# EAGLE design voltage regulator (EAGLE 7.7.0)
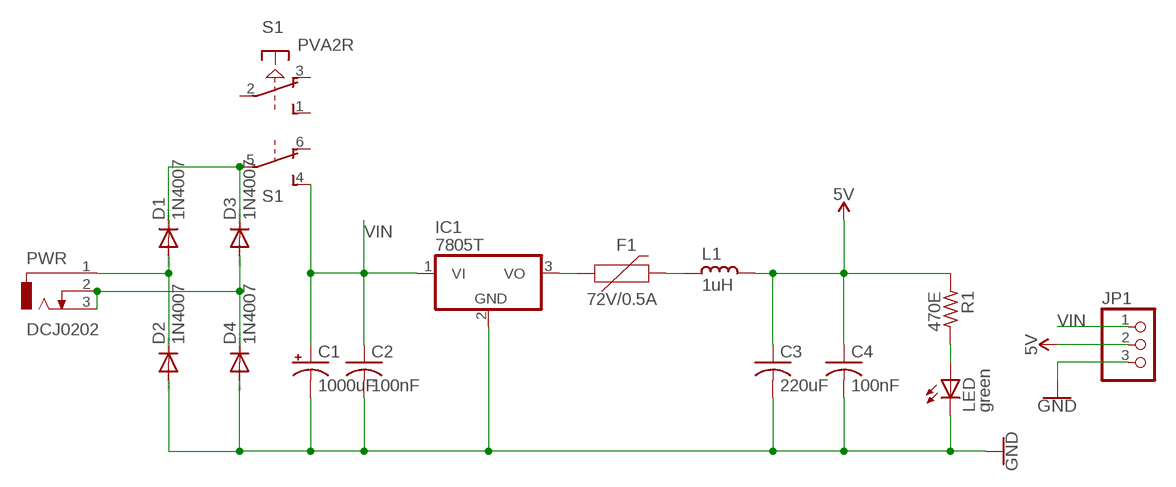
[diagram p0: schematic, sheet 1]

## Parts
C1  1000uF  CPOL-USE5-13  [E5-13]
C2  100nF  C-USC0805  [C0805]
C3  220uF  C-USC0805  [C0805]
C4  100nF  C-USC0805  [C0805]
D1  1N4007  1N4004  [DO41-10]
D2  1N4007  1N4004  [DO41-10]
D3  1N4007  1N4004  [DO41-10]
D4  1N4007  1N4004  [DO41-10]
F1  72V/0.5A  PPTC_PTH  [PTH]
IC1  7805T  [TO220H]
JP1  PINHD-1X3  [1X03]
L1  1uH  L_0805  [L0805]
LED  green  LEDCHIP-LED0805  [CHIP-LED0805]
PWR  DCJ0202  [DCJ0202]
R1  470E  R_0805  [R0805]
S1  PVA2R  [PVA2R]

## Nets
5V: C3.1 C4.1 JP1.2 L1.1 R1.1
GND: C1.- C2.2 C3.2 C4.2 D2.A D4.A IC1.2(GND) JP1.3 LED.C
N$1: D1.C D3.C S1.5(2:P)
N$2: D1.A D2.C PWR.1
N$5: D3.A D4.C PWR.2 PWR.3
N$7: F1.P$1 IC1.3(VO)
N$8: F1.P$2 L1.2
N$11: LED.A R1.2
VIN: C1.+ C2.1 IC1.1(VI) JP1.1 S1.4(2:S)
Unconnected: S1.1(1:S) S1.2(1:P) S1.3(1:O) S1.6(2:O)

## Library data of the parts
C1 = rcl:CPOL-US: POLARIZED CAPACITOR, American symbol
C2-C4 = rcl:C-US: CAPACITOR, American symbol
D1-D4 = diode:1N4004: DIODE general purpose rectifier, 1 A
F1 = SparkFun-Fuses:PPTC: Resettable Fuse PPTC Resettable Fuse. Really a sort of resistor with a polymeric positive temperature coefficient whose resistance increases dramatically with an increase in temperature. When heated by the power passing through the resistance rises causing the current to be limited, protecting the circuit. This is achieved by the transition of the polymer from a crystalline to an amorphous state where the conductive carbon separates breaking the conductive pathways found in the cool crystalline structure. When a PPTC cools back down it resumes conducting letting the circuit turn back on. SparkFun Products: SparkFun RedBoard - Programmed with Arduino <https://www.sparkfun.com/products/12757> Pro Micro - 5V/16MHz <https://www.sparkfun.com/products/12640> Arduino Pro 328 - 5V/16MHz <https://www.sparkfun.com/products/10915> MP3 Trigger <https://www.sparkfun.com/products/13720>; PROD_ID: RES-08490; VALUE: 72V/0.25A
IC1 = linear:78*: Positive VOLTAGE REGULATOR Source: http://cache.national.com/ds/LM/LM78L05.pdf http://www.fairchildsemi.com/ds/LM/LM7805.pdf
JP1 = pinhead:PINHD-1X3: PIN HEADER
L1 = rc-master-smd:L_: INDUCTOR
LED = led:LED: LED OSRAM: - CHIPLED LG R971, LG N971, LY N971, LG Q971, LY Q971, LO R971, LY R971 LH N974, LH R974 LS Q976, LO Q976, LY Q976 LO Q996 - Hyper CHIPLED LW Q18S LB Q993, LB Q99A, LB R99A - SideLED LS A670, LO A670, LY A670, LG A670, LP A670 LB A673, LV A673, LT A673, LW A673 LH A674 LY A675 LS A676, LA A676, LO A676, LY A676, LW A676 LS A679, LY A679, LG A679 - Hyper Micro SIDELED® LS Y876, LA Y876, LO Y876, LY Y876 LT Y87S - SmartLED LW L88C, LW L88S LB L89C, LB L89S, LG L890 LS L89K, LO L89K, LY L89K LS L896, LA L896, LO L896, LY L896 - TOPLED LS T670, LO T670, LY T670, LG T670, LP T670 LSG T670, LSP T670, LSY T670, LOP T670, LYG T670 LG T671, LOG T671, LSG T671 LB T673, LV T673, LT T673, LW T673 LH T674 LS T676, LA T676, LO T676, LY T676, LB T676, LH T676, LSB T676, LW T676 LB T67C, LV T67C, LT T67C, LS T67K, LO T67K, LY T67K, LW E67C LS E67B, LA E67B, LO E67B, LY E67B, LB E67C, LV E67C, LT E67C LW T67C LS T679, LY T679, LG T679 LS T770, LO T770, LY T770, LG T770, LP T770 LB T773, LV T773, LT T773, LW T773 LH T774 LS E675, LA E675, LY E675, LS T675 LS T776, LA T776, LO T776, LY T776, LB T776 LHGB T686 LT T68C, LB T68C - Hyper Mini TOPLED® LB M676 - Mini TOPLED Santana® LG M470 LS M47K, LO M47K, LY M47K Source: http://www.osram.convergy.de LUXEON: - LUMILED® LXK2-PW12-R00, LXK2-PW12-S00, LXK2-PW14-U00, LXK2-PW14-V00 LXK2-PM12-R00, LXK2-PM12-S00, LXK2-PM14-U00 LXK2-PE12-Q00, LXK2-PE12-R00, LXK2-PE12-S00, LXK2-PE14-T00, LXK2-PE14-U00 LXK2-PB12-K00, LXK2-PB12-L00, LXK2-PB12-M00, LXK2-PB14-N00, LXK2-PB14-P00, LXK2-PB14-Q00 LXK2-PR12-L00, LXK2-PR12-M00, LXK2-PR14-Q00, LXK2-PR14-R00 LXK2-PD12-Q00, LXK2-PD12-R00, LXK2-PD12-S00 LXK2-PH12-R00, LXK2-PH12-S00 LXK2-PL12-P00, LXK2-PL12-Q00, LXK2-PL12-R00 Source: www.luxeon.com KINGBRIGHT: KA-3528ASYC Source: www.kingbright.com
PWR = con-jack:DCJ0202: DC POWER JACK Source: DCJ0202.pdf; OC_FARNELL: unknown; OC_NEWARK: unknown
R1 = rc-master-smd:R_: RESISTOR
S1 = switch-misc:PVA2R: ITT SWITCH

## Net classes
0 default: width 0.305 mm, drill 0.508 mm, clearance 0.254 mm

## Board
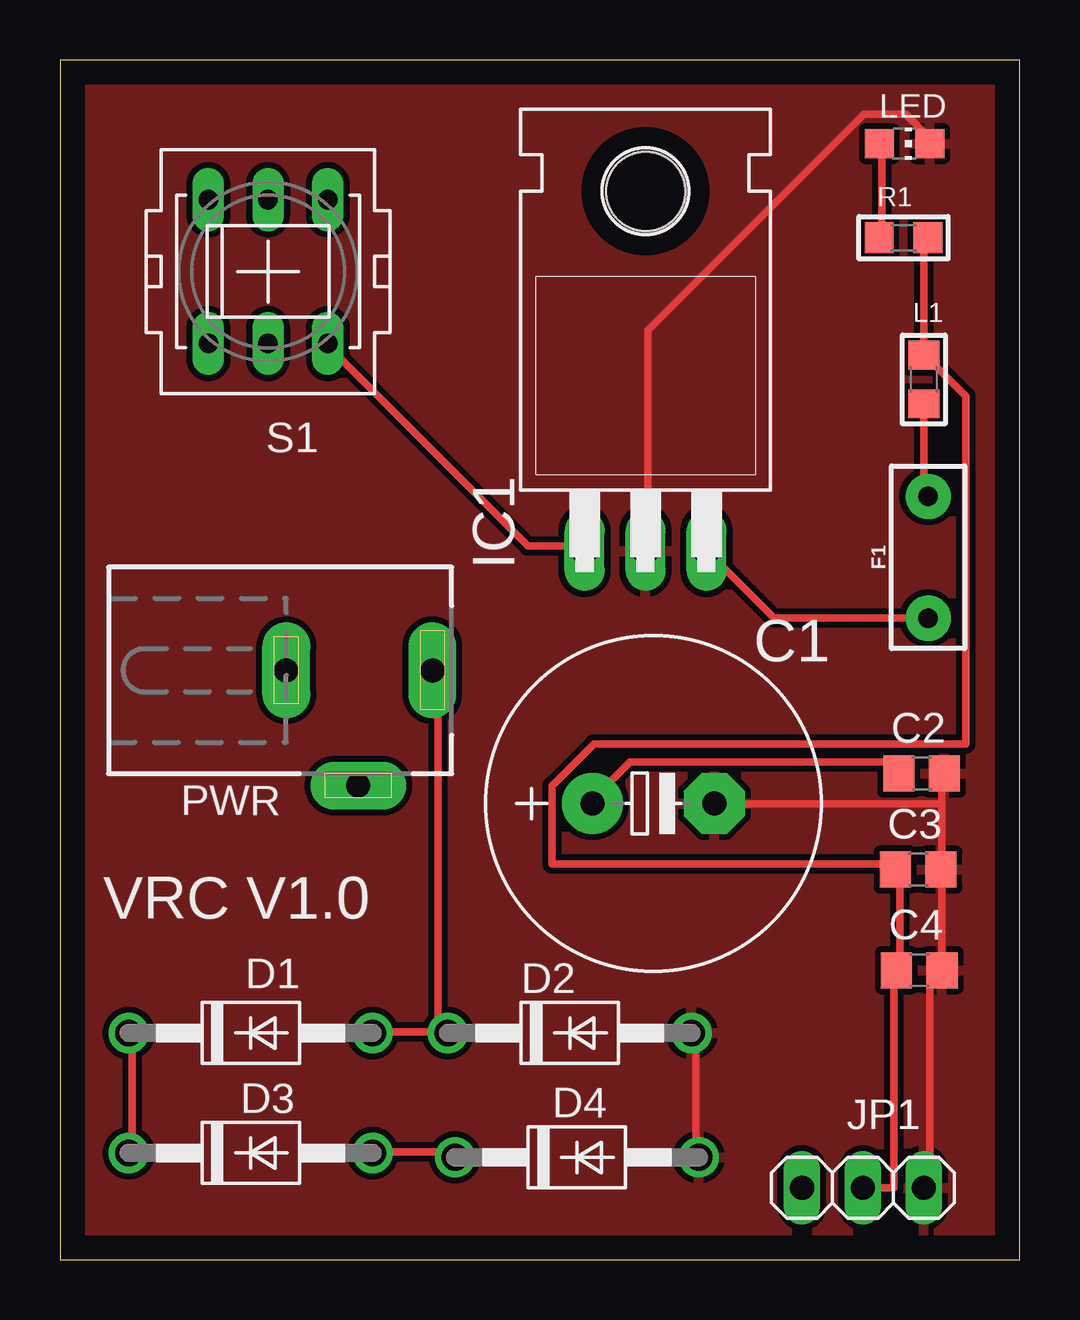
[diagram p1: board, top side]
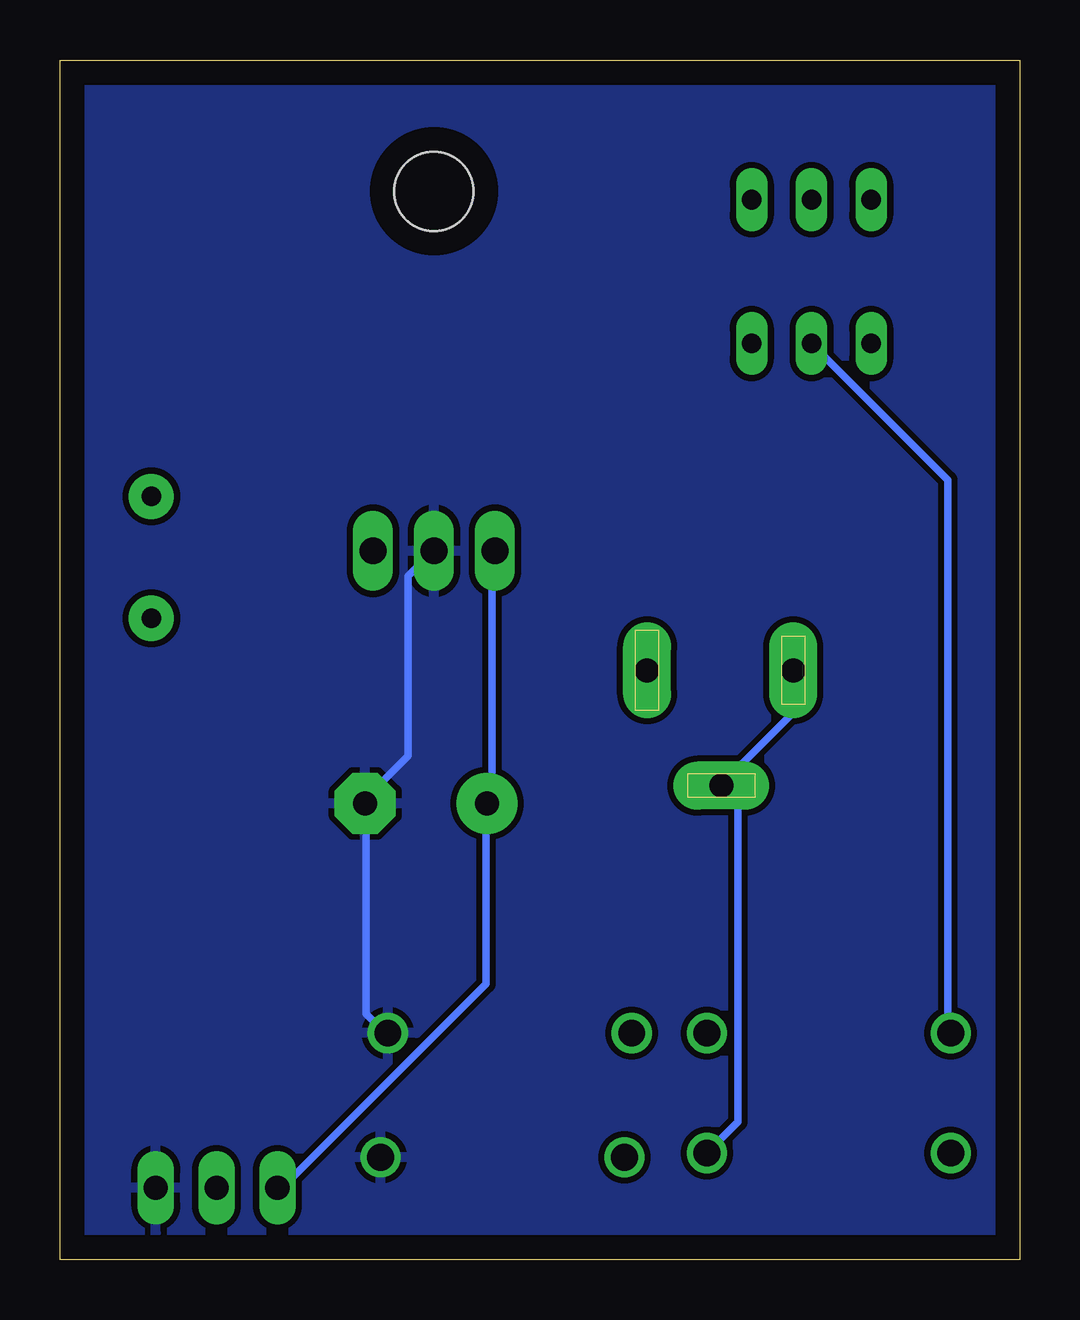
[diagram p2: board, bottom side, seen from below]

Size 40 x 50 mm. Coordinates in mm from the lower left corner, seen from the top.
Outline: 0,0 40,0 40,50 0,50 0,0
Copper layers (1*16): Top 0.035mm / dielectric 1.5mm / Bottom 0.035mm
Design rules "default": minimum track width 10mil, minimum drill 24mil, track to track 8mil, track to pad 8mil, pad to pad 8mil, via to via 8mil, smd to smd 8mil, copper to edge 40mil, drill to drill 8mil, minimum pad ring 10mil, minimum via ring 8mil, stop-mask expansion 4mil, vias tented up to drill 0mil, thermal gap 10mil

### Footprints (pad centres in the part's own frame; a part is rotated, then mirrored left to right if it is on the bottom)
E5-13 = drill 1.016 pad 2.54: + -2.54,0 | drill 1.016 pad 2.54 octagon: - 2.54,0
C0805 = smd 1.3 x 1.5: 1 -0.95,0; 2 0.95,0
DO41-10 = drill 1.118: A 5.08,0; C -5.08,0
PTH = drill 0.8 pad 1.88: P$1 -2.54,0; P$2 2.54,0
TO220H = drill 1.118 long: 1 -2.54,-10.16; 2 0,-10.16; 3 2.54,-10.16 | hole 3.302: 0,4.826
1X03 = drill 1.016 long: 1 -2.54,0; 2 0,0; 3 2.54,0
L0805 = smd 1.2 x 1.3: 1 -1.016,0; 2 1.016,0
CHIP-LED0805 = smd 1.2 x 1.2: A 0,-1.05; C 0,1.05
DCJ0202 = drill 1 pad 2 long: 1 0,3.1; 2 4.8,0; 3 0,-3
R0805 = smd 1.2 x 1.3: 1 -1.016,0; 2 1.016,0
PVA2R = drill 0.813 long: 1 -2.997,2.489; 2 -2.997,0; 3 -2.997,-2.489; 4 2.997,2.489; 5 2.997,0; 6 2.997,-2.489

### Placement (x,y rotation side)
C1  24.74,19.01 0 top
C2  35.92,20.26 0 top
C3  35.77,16.26 0 top
C4  35.82,12.06 0 top
D1  7.95,9.44 0 top
D2  21.25,9.44 0 top
D3  7.95,4.44 0 top
D4  21.55,4.26 0 top
F1  36.19,29.27 90 top
IC1  24.41,39.7 0 top
JP1  33.47,2.99 0 top
L1  36.01,36.68 270 top
LED  35.21,46.51 270 top
PWR  12.43,24.56 270 top
R1  35.16,42.59 180 top
S1  8.67,41.18 270 top

### Tracks (layer width: path | path; a pad name or v marks a point on that pad's centre or on a via)
5V
  Top 0.305: R1.1 36,42.5 36,37.75 L1.1 36.25,37.5 37.75,36 37.75,21.5 22.25,21.5 20.5,19.75 20.5,16.5 34.75,16.5 C3.1 35,16.25 35,12.25 C4.1 34.75,12 34.75,3 33.5,3 JP1.2
GND
  Top 0.305: LED.C 36.25,46.75 35.25,47.75 33.5,47.75 24.5,38.75 24.5,29.75 IC1.2 | D2.A 26.5,9.25 26.5,4.5 D4.A | 36.75,19 36.75,20.25 C2.2 | 36.75,19 36.75,16.5 C3.2 36.75,16.25 36.75,12.25 C4.2 36.75,12 36.25,12 36.25,3 JP1.3 | 36.75,19 27.5,19 C1.-
  Bottom 0.305: D2.A 26.5,9.5 27.25,10.25 27.25,19 C1.- 27.25,19.25 25.5,21 25.5,28.5 24.5,29.5 IC1.2
  pour Top: 0,0 0,50 40,50 40,0
  pour Bottom: 0,0 0,50 40,50 40,0
N$1
  Top 0.305: D3.C 3,4.5 3,9.25 D1.C
  Bottom 0.305: S1.5 8.5,38 3,32.5 3,9.5 D1.C
N$2
  Top 0.305: 15.75,9.5 16,9.5 D2.C 15.75,9.5 | 15.75,9.5 13.25,9.5 D1.A | 15.75,9.5 15.75,24.5 PWR.1
N$5
  Top 0.305: D3.A 13.25,4.5 16.25,4.5 D4.C
  Bottom 0.305: 11.75,20.5 9.5,22.75 9.5,24.5 PWR.3 | 11.75,20.5 12.25,20 PWR.2 11.75,20.5 | 11.75,20.5 11.75,5.75 13,4.5 D3.A
N$7
  Top 0.305: IC1.3 27,29.5 29.75,26.75 36,26.75 F1.P$1
N$8
  Top 0.305: L1.2 36,35.5 36,32 F1.P$2
N$11
  Top 0.305: LED.A 34.25,46.5 34.25,42.75 R1.2
VIN
  Top 0.305: S1.4 11.25,38 19.5,29.75 21.75,29.75 IC1.1 | C2.1 34.75,20.5 34.5,20.75 23.75,20.75 22.25,19.25 C1.+
  Bottom 0.305: JP1.1 30.75,3 22.25,11.5 22.25,19 C1.+ 22,19.25 22,29.5 IC1.1

### Text on the board
tPlace: VRC V1.0